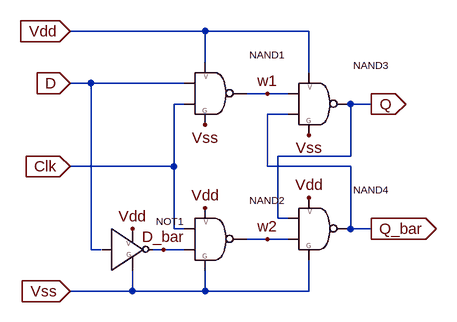
[diagram p0: schematic D_Latch.asc]
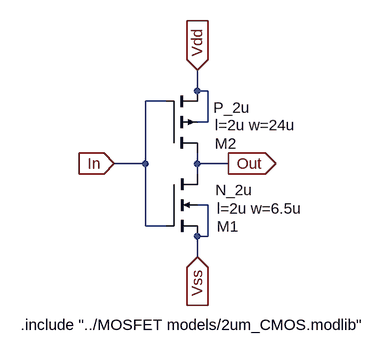
[diagram p1: sub-circuit not.asc]
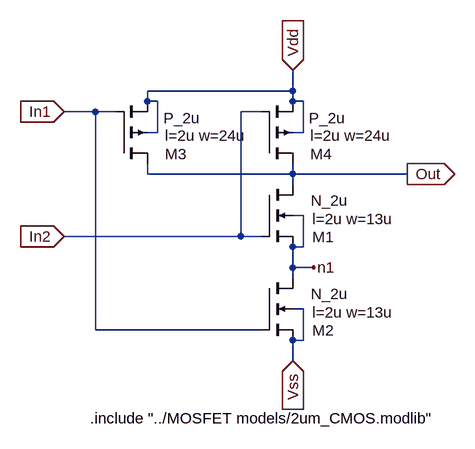
[diagram p2: sub-circuit nand2.asc]
D_Latch.asc, the LTspice schematic file:
Version 4
SHEET 1 880 680
WIRE 320 -16 112 -16
WIRE 480 -16 320 -16
WIRE 320 32 320 -16
WIRE 480 48 480 -16
WIRE 144 64 112 64
WIRE 288 64 144 64
WIRE 416 80 384 80
WIRE 448 80 416 80
WIRE 288 96 272 96
WIRE 576 96 544 96
WIRE 448 112 416 112
WIRE 544 176 544 96
WIRE 544 176 432 176
WIRE 272 192 272 96
WIRE 272 192 112 192
WIRE 416 192 416 112
WIRE 544 192 416 192
WIRE 432 272 432 176
WIRE 448 272 432 272
WIRE 272 288 272 192
WIRE 288 288 272 288
WIRE 544 288 544 192
WIRE 576 288 544 288
WIRE 416 304 384 304
WIRE 448 304 416 304
WIRE 144 320 144 64
WIRE 160 320 144 320
WIRE 256 320 240 320
WIRE 288 320 256 320
WIRE 208 384 208 352
WIRE 208 384 112 384
WIRE 320 384 320 352
WIRE 320 384 208 384
WIRE 480 384 480 336
WIRE 480 384 320 384
FLAG 112 64 D
IOPIN 112 64 In
FLAG 112 192 Clk
IOPIN 112 192 In
FLAG 112 -16 Vdd
IOPIN 112 -16 In
FLAG 112 384 Vss
IOPIN 112 384 In
FLAG 320 128 Vss
FLAG 480 144 Vss
FLAG 208 288 Vdd
FLAG 320 256 Vdd
FLAG 480 240 Vdd
FLAG 576 96 Q
IOPIN 576 96 Out
FLAG 576 288 Q_bar
IOPIN 576 288 Out
FLAG 256 320 D_bar
FLAG 416 80 w1
FLAG 416 304 w2
SYMBOL NOT 176 320 R0
SYMATTR InstName NOT1
SYMBOL NAND2 304 80 R0
SYMATTR InstName NAND1
SYMBOL NAND2 304 304 R0
SYMATTR InstName NAND2
SYMBOL NAND2 464 96 R0
SYMATTR InstName NAND3
SYMBOL NAND2 464 288 R0
SYMATTR InstName NAND4

not.asc, the sub-circuit schematic file:
Version 4
SHEET 1 880 680
WIRE 192 64 192 32
WIRE 208 64 192 64
WIRE 144 80 112 80
WIRE 208 112 208 64
WIRE 208 112 192 112
WIRE 112 176 112 80
WIRE 112 176 64 176
WIRE 192 176 192 160
WIRE 240 176 192 176
WIRE 192 192 192 176
WIRE 208 240 192 240
WIRE 112 272 112 176
WIRE 144 272 112 272
WIRE 208 288 208 240
WIRE 208 288 192 288
WIRE 192 320 192 288
FLAG 192 32 Vdd
IOPIN 192 32 In
FLAG 192 320 Vss
IOPIN 192 320 In
FLAG 64 176 In
IOPIN 64 176 In
FLAG 240 176 Out
IOPIN 240 176 Out
SYMBOL nmos4 144 192 R0
WINDOW 0 78 81 Left 2
WINDOW 3 76 25 Left 2
WINDOW 123 78 53 Left 2
SYMATTR InstName M1
SYMATTR Value N_2u
SYMATTR Value2 l=2u w=6.5u
SYMBOL pmos4 144 160 M180
WINDOW 0 75 15 Left 2
WINDOW 3 73 70 Left 2
WINDOW 123 75 43 Left 2
SYMATTR InstName M2
SYMATTR Value P_2u
SYMATTR Value2 l=2u w=24u
TEXT -80 424 Left 2 !.include "../MOSFET models/2um_CMOS.modlib"

nand2.asc, the sub-circuit schematic file:
Version 4
SHEET 1 880 680
WIRE 192 48 192 16
WIRE 192 48 -32 48
WIRE -32 64 -32 48
WIRE -16 64 -32 64
WIRE 192 64 192 48
WIRE 208 64 192 64
WIRE -112 80 -160 80
WIRE -80 80 -112 80
WIRE 144 80 112 80
WIRE -16 112 -16 64
WIRE -16 112 -32 112
WIRE 208 112 208 64
WIRE 208 112 192 112
WIRE -32 176 -32 160
WIRE 192 176 192 160
WIRE 192 176 -32 176
WIRE 368 176 192 176
WIRE 192 192 192 176
WIRE 208 240 192 240
WIRE 112 272 112 80
WIRE 112 272 -160 272
WIRE 144 272 112 272
WIRE 208 288 208 240
WIRE 208 288 192 288
WIRE 192 320 192 288
WIRE 224 320 192 320
WIRE 192 336 192 320
WIRE 208 384 192 384
WIRE -112 416 -112 80
WIRE 144 416 -112 416
WIRE 208 432 208 384
WIRE 208 432 192 432
WIRE 192 464 192 432
FLAG 192 16 Vdd
IOPIN 192 16 In
FLAG 192 464 Vss
IOPIN 192 464 In
FLAG -160 80 In1
IOPIN -160 80 In
FLAG -160 272 In2
IOPIN -160 272 In
FLAG 368 176 Out
IOPIN 368 176 Out
FLAG 224 320 n1
SYMBOL nmos4 144 192 R0
WINDOW 0 78 81 Left 2
WINDOW 3 76 25 Left 2
WINDOW 123 78 53 Left 2
SYMATTR InstName M1
SYMATTR Value N_2u
SYMATTR Value2 l=2u w=13u
SYMBOL pmos4 144 160 M180
WINDOW 0 75 15 Left 2
WINDOW 3 73 70 Left 2
WINDOW 123 75 43 Left 2
SYMATTR InstName M4
SYMATTR Value P_2u
SYMATTR Value2 l=2u w=24u
SYMBOL pmos4 -80 160 M180
WINDOW 0 75 15 Left 2
WINDOW 3 73 70 Left 2
WINDOW 123 75 43 Left 2
SYMATTR InstName M3
SYMATTR Value P_2u
SYMATTR Value2 l=2u w=24u
SYMBOL nmos4 144 336 R0
WINDOW 0 78 81 Left 2
WINDOW 3 76 25 Left 2
WINDOW 123 78 53 Left 2
SYMATTR InstName M2
SYMATTR Value N_2u
SYMATTR Value2 l=2u w=13u
TEXT -120 552 Left 2 !.include "../MOSFET models/2um_CMOS.modlib"

The netlist it stands for:
* D_Latch.asc
XNOT1 D D_bar Vdd Vss not
XNAND1 D Clk w1 Vdd Vss nand2
XNAND2 Clk D_bar w2 Vdd Vss nand2
XNAND3 w1 Q_bar Q Vdd Vss nand2
XNAND4 Q w2 Q_bar Vdd Vss nand2

* block symbol definitions
.subckt not In Out Vdd Vss
M1 Out In Vss Vss N_2u l=2u w=6.5u
M2 Out In Vdd Vdd P_2u l=2u w=24u
.include "../MOSFET models/2um_CMOS.modlib"
.ends not

.subckt nand2 In1 In2 Out Vdd Vss
M1 Out In2 n1 n1 N_2u l=2u w=13u
M4 Out In2 Vdd Vdd P_2u l=2u w=24u
M3 Out In1 Vdd Vdd P_2u l=2u w=24u
M2 n1 In1 Vss Vss N_2u l=2u w=13u
.include "../MOSFET models/2um_CMOS.modlib"
.ends nand2

.model NMOS NMOS
.model PMOS PMOS
.lib standard.mos
.backanno
.end